# EAGLE design CommandeMoteurs (EAGLE 6.6.0)
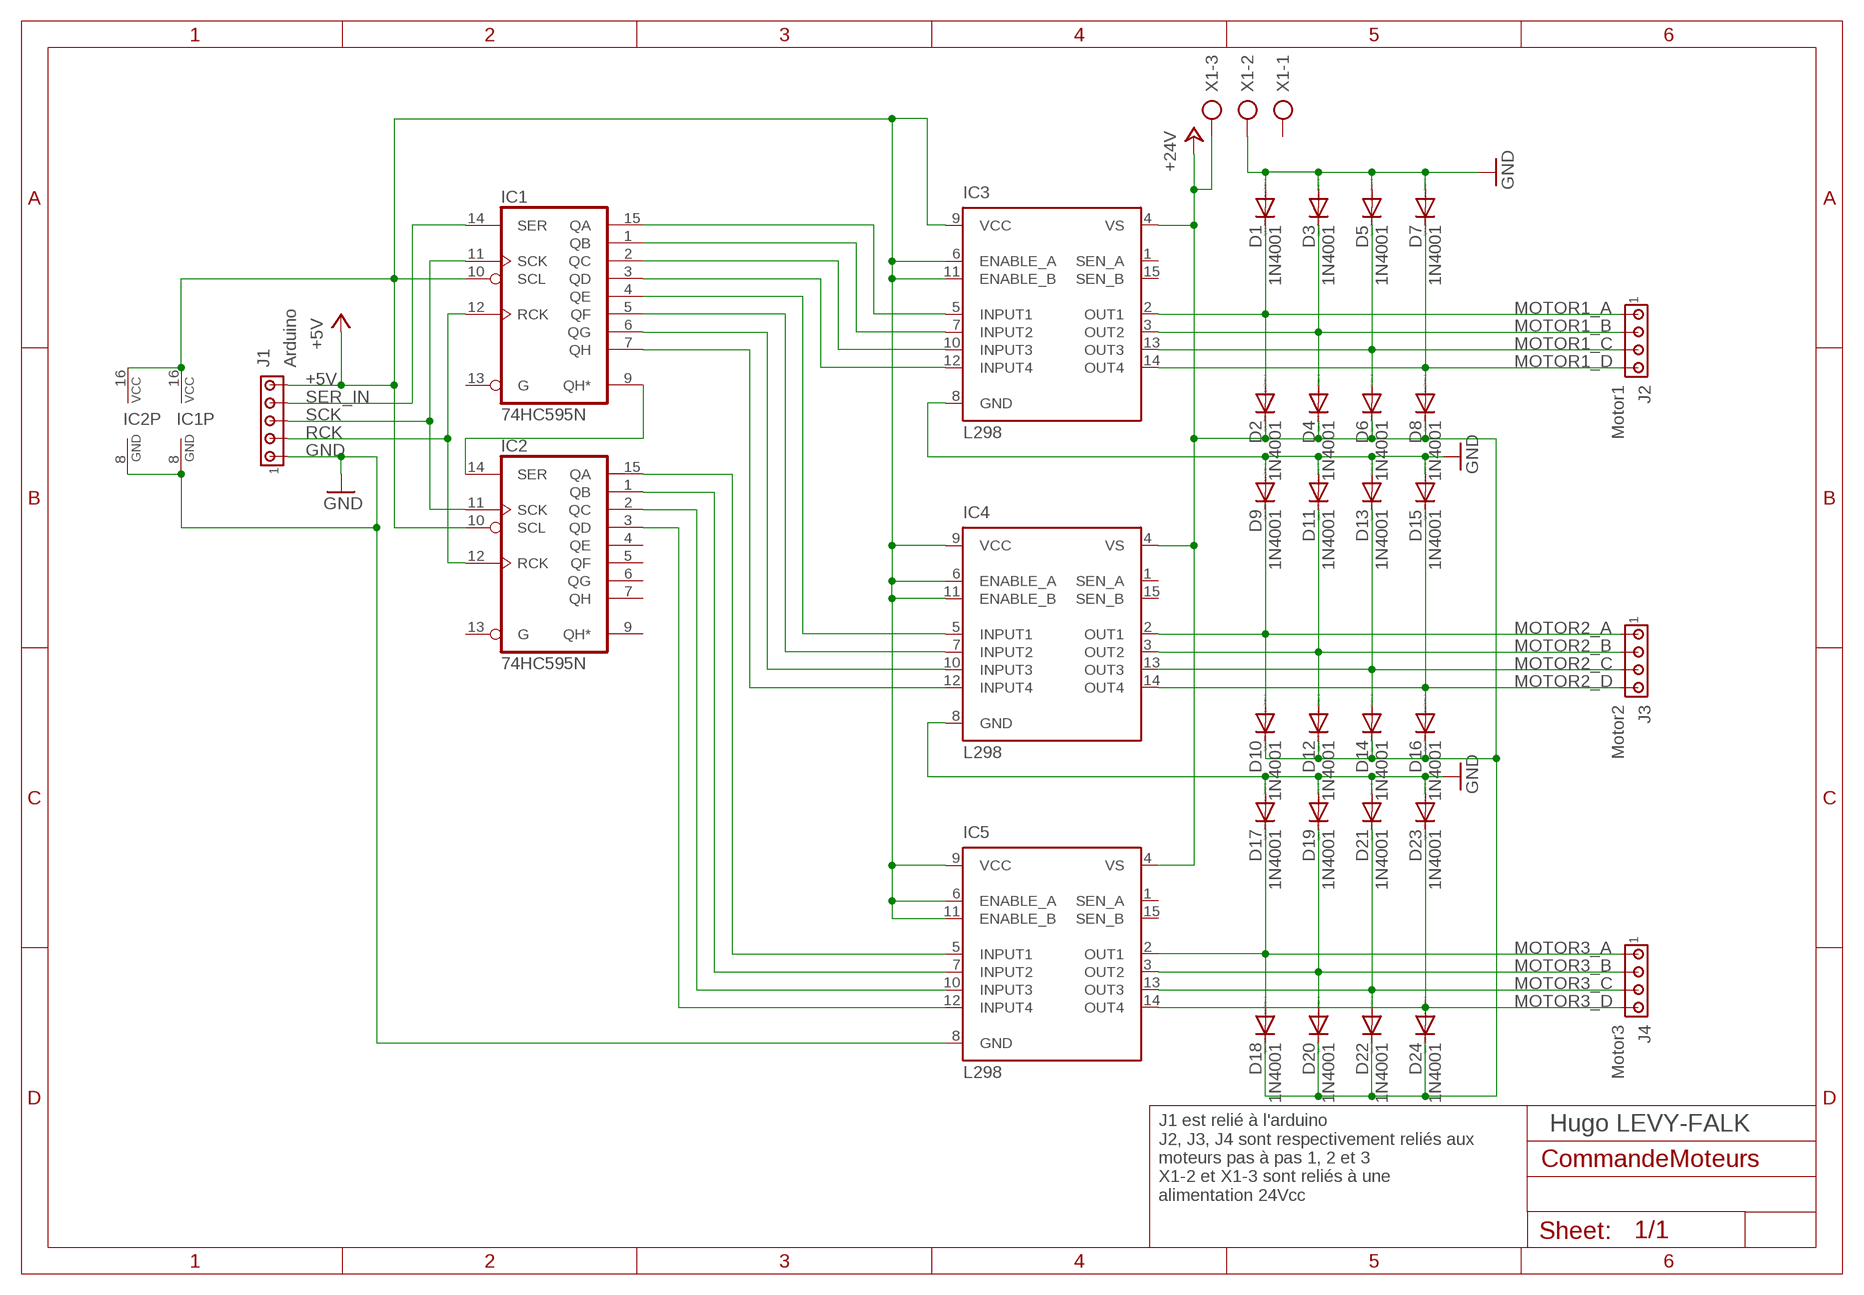
[diagram p0: schematic, sheet 1]

## Parts
D1  1N4001  DIODE-DO35-10  [DO35-10]
D2  1N4001  DIODE-DO35-10  [DO35-10]
D3  1N4001  DIODE-DO35-10  [DO35-10]
D4  1N4001  DIODE-DO35-10  [DO35-10]
D5  1N4001  DIODE-DO35-10  [DO35-10]
D6  1N4001  DIODE-DO35-10  [DO35-10]
D7  1N4001  DIODE-DO35-10  [DO35-10]
D8  1N4001  DIODE-DO35-10  [DO35-10]
D9  1N4001  DIODE-DO35-10  [DO35-10]
D10  1N4001  DIODE-DO35-10  [DO35-10]
D11  1N4001  DIODE-DO35-10  [DO35-10]
D12  1N4001  DIODE-DO35-10  [DO35-10]
D13  1N4001  DIODE-DO35-10  [DO35-10]
D14  1N4001  DIODE-DO35-10  [DO35-10]
D15  1N4001  DIODE-DO35-10  [DO35-10]
D16  1N4001  DIODE-DO35-10  [DO35-10]
D17  1N4001  DIODE-DO35-10  [DO35-10]
D18  1N4001  DIODE-DO35-10  [DO35-10]
D19  1N4001  DIODE-DO35-10  [DO35-10]
D20  1N4001  DIODE-DO35-10  [DO35-10]
D21  1N4001  DIODE-DO35-10  [DO35-10]
D22  1N4001  DIODE-DO35-10  [DO35-10]
D23  1N4001  DIODE-DO35-10  [DO35-10]
D24  1N4001  DIODE-DO35-10  [DO35-10]
IC1  74HC595N  [DIL16]
IC2  74HC595N  [DIL16]
IC3  L298  [MULTIWATT-15]
IC4  L298  [MULTIWATT-15]
IC5  L298  [MULTIWATT-15]
J1  Arduino  MTA05-100  [10X05MTA]
J2  Motor1  MTA04-100  [10X04MTA]
J3  Motor2  MTA04-100  [10X04MTA]
J4  Motor3  MTA04-100  [10X04MTA]
X1  AK500/3  [AK500/3]

## Nets
+5V: IC1.10(SCL) IC1.16(VCC) IC2.10(SCL) IC2.16(VCC) IC3.6(ENABLE_A) IC3.9(VCC) IC3.11(ENABLE_B) IC4.6(ENABLE_A) IC4.9(VCC) IC4.11(ENABLE_B) IC5.6(ENABLE_A) IC5.9(VCC) IC5.11(ENABLE_B) J1.5
+24V: D2.C D4.C D6.C D8.C D10.C D12.C D14.C D16.C D18.C D20.C D22.C D24.C IC3.4(VS) IC4.4(VS) IC5.4(VS) X1.3
GND: D1.A D3.A D5.A D7.A D9.A D11.A D13.A D15.A D17.A D19.A D21.A D23.A IC1.8(GND) IC2.8(GND) IC3.8(GND) IC4.8(GND) IC5.8(GND) J1.1 X1.2
MOTOR1_A: D1.C D2.A IC3.2(OUT1) J2.1
MOTOR1_B: D3.C D4.A IC3.3(OUT2) J2.2
MOTOR1_C: D5.C D6.A IC3.13(OUT3) J2.3
MOTOR1_D: D7.C D8.A IC3.14(OUT4) J2.4
MOTOR2_A: D9.C D10.A IC4.2(OUT1) J3.1
MOTOR2_B: D11.C D12.A IC4.3(OUT2) J3.2
MOTOR2_C: D13.C D14.A IC4.13(OUT3) J3.3
MOTOR2_D: D15.C D16.A IC4.14(OUT4) J3.4
MOTOR3_A: D17.C D18.A IC5.2(OUT1) J4.1
MOTOR3_B: D19.C D20.A IC5.3(OUT2) J4.2
MOTOR3_C: D21.C D22.A IC5.13(OUT3) J4.3
MOTOR3_D: D23.C D24.A IC5.14(OUT4) J4.4
N$4: IC1.15(QA) IC3.5(INPUT1)
N$5: IC1.1(QB) IC3.7(INPUT2)
N$6: IC1.2(QC) IC3.10(INPUT3)
N$7: IC1.3(QD) IC3.12(INPUT4)
N$8: IC1.4(QE) IC4.5(INPUT1)
N$9: IC1.5(QF) IC4.7(INPUT2)
N$10: IC1.6(QG) IC4.10(INPUT3)
N$11: IC1.7(QH) IC4.12(INPUT4)
N$12: IC1.9(QH*) IC2.14(SER)
N$13: IC2.15(QA) IC5.5(INPUT1)
N$14: IC2.1(QB) IC5.7(INPUT2)
N$15: IC2.2(QC) IC5.10(INPUT3)
N$16: IC2.3(QD) IC5.12(INPUT4)
RCK: IC1.12(RCK) IC2.12(RCK) J1.2
SCK: IC1.11(SCK) IC2.11(SCK) J1.3
SER_IN: IC1.14(SER) J1.4
Unconnected: IC1.13(G) IC2.4(QE) IC2.5(QF) IC2.6(QG) IC2.7(QH) IC2.9(QH*) IC2.13(G) IC3.1(SEN_A) IC3.15(SEN_B) IC4.1(SEN_A) IC4.15(SEN_B) IC5.1(SEN_A) IC5.15(SEN_B) X1.1

## Notes on the sheet
- J1 est relié à l'arduino
  J2, J3, J4 sont respectivement reliés aux
  moteurs pas à pas 1, 2 et 3
  X1-2 et X1-3 sont reliés à une
  alimentation 24Vcc
- Hugo LEVY-FALK

## Library data of the parts
D1-D24 = diode:DIODE-: DIODE
IC1 IC2 = 74xx-eu:74*595: 8-bit SHIFT REGISTER, output latch
IC3-IC5 = st-microelectronics:L298: DUAL FULL-BRIDGE DRIVER; MPN: L298N; OC_FARNELL: 1589425; OC_NEWARK: 32M1527
J1 = con-amp:MTA05-100: AMP connector
J2-J4 = con-amp:MTA04-100: AMP connector
X1 = con-ptr500:AK500/3: CONNECTOR; OC_FARNELL: unknown; OC_NEWARK: unknown

## Board
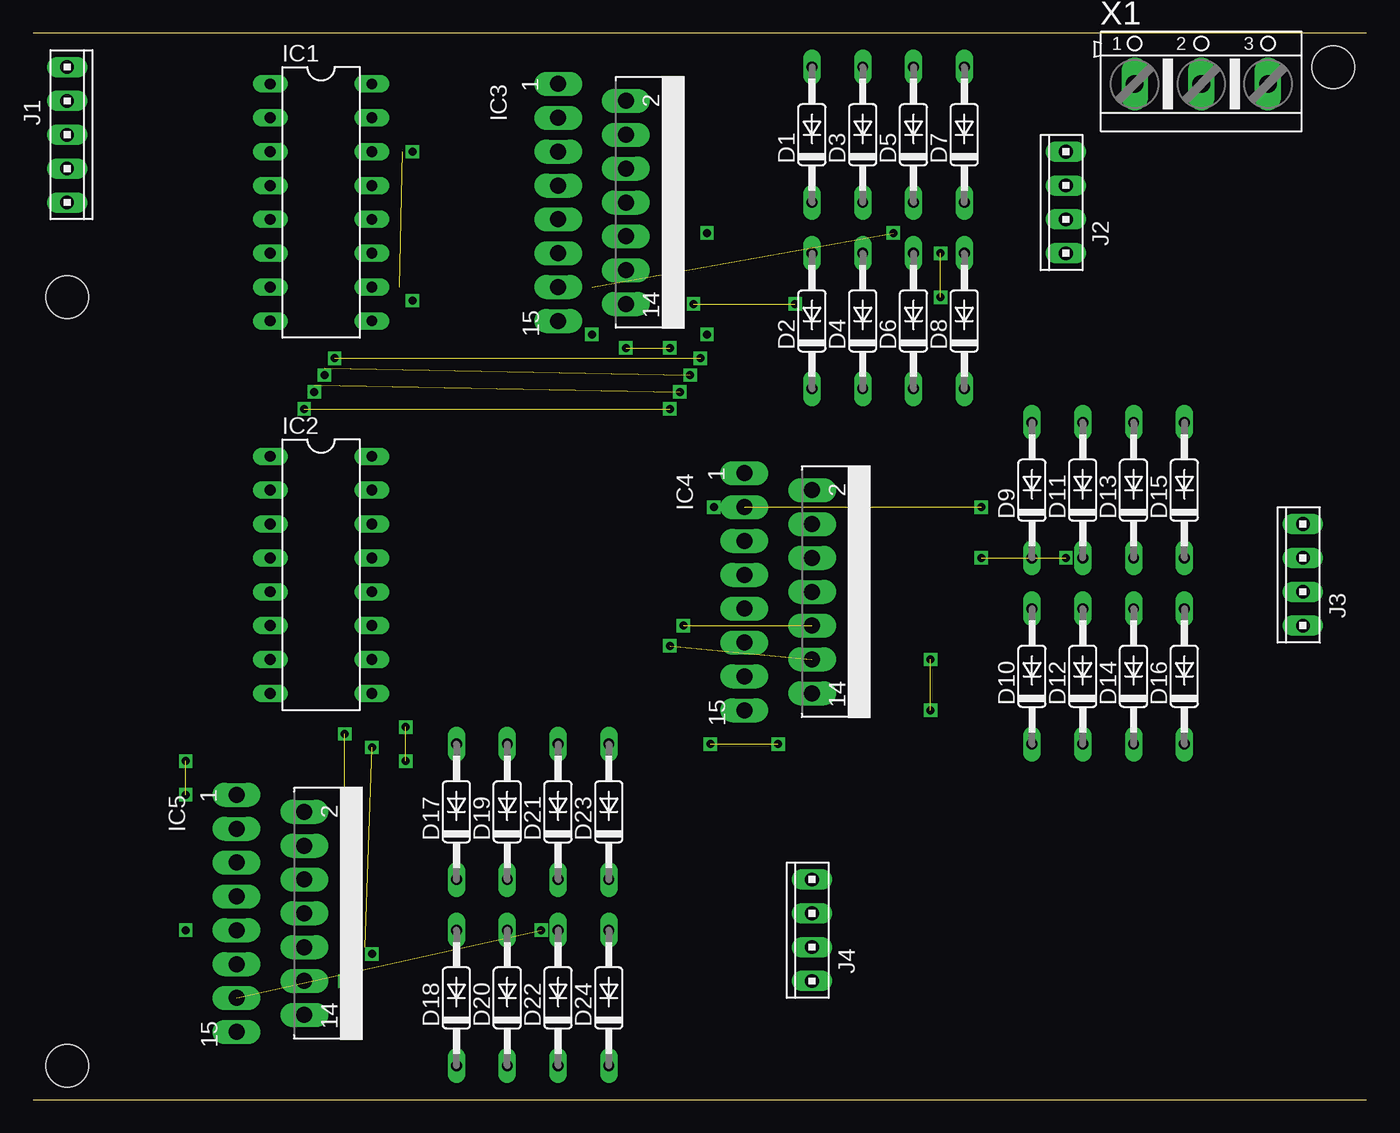
[diagram p1: board, top side]
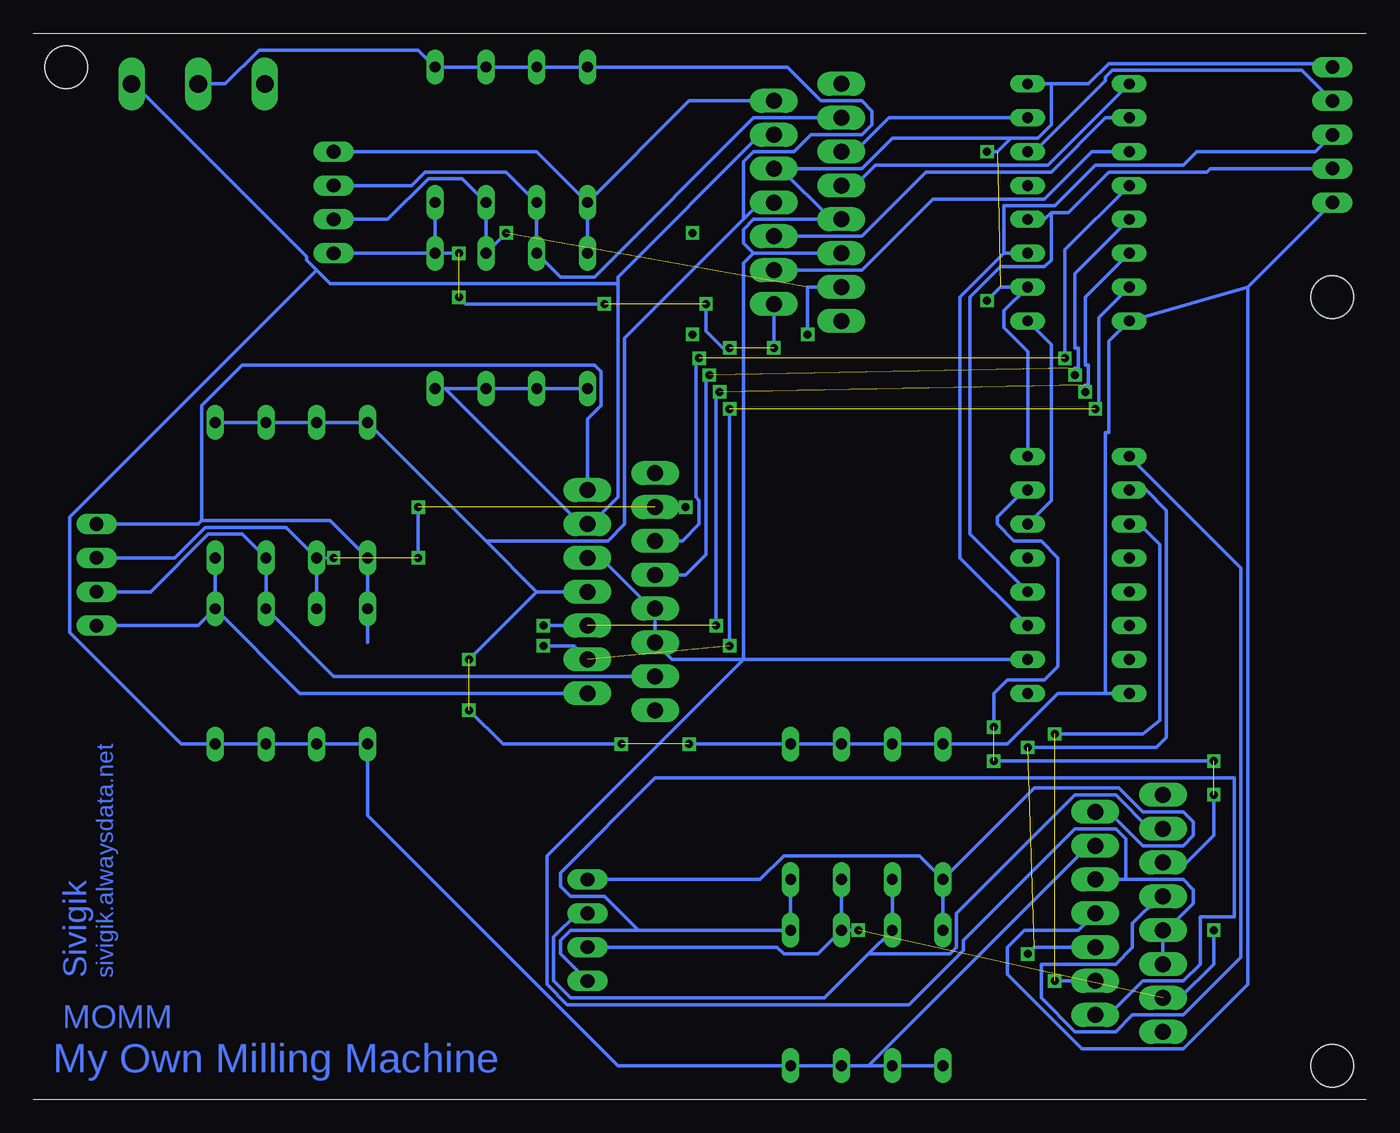
[diagram p2: board, bottom side, seen from below]

Size 100 x 80 mm. Coordinates in mm from the lower left corner, seen from the top.
Outline: 0,0 100,0
Outline: 100,80 0,80
Copper layers (1*16): Top 0.035mm / dielectric 1.5mm / Bottom 0.035mm
Design rules "default": minimum track width 10mil, minimum drill 24mil, track to track 8mil, track to pad 8mil, pad to pad 8mil, via to via 8mil, smd to smd 8mil, copper to edge 40mil, drill to drill 8mil, minimum pad ring 10mil, minimum via ring 8mil, stop-mask expansion 4mil, vias tented up to drill 0mil, thermal gap 10mil
Holes 3.2 mm at 2.54,2.54 97.54,77.47 2.54,60.2

### Footprints (pad centres in the part's own frame; a part is rotated, then mirrored left to right if it is on the bottom)
DO35-10 = drill 0.813 long: A 5.08,0; C -5.08,0
DIL16 = drill 0.813 long: 1 -8.89,-3.81; 2 -6.35,-3.81; 3 -3.81,-3.81; 4 -1.27,-3.81; 5 1.27,-3.81; 6 3.81,-3.81; 7 6.35,-3.81; 8 8.89,-3.81; 9 8.89,3.81; 10 6.35,3.81; 11 3.81,3.81; 12 1.27,3.81; 13 -1.27,3.81; 14 -3.81,3.81; 15 -6.35,3.81; 16 -8.89,3.81
MULTIWATT-15 = drill 1.2 long: 1 -8.89,-7.62; 2 -7.62,-2.54; 3 -6.35,-7.62; 4 -5.08,-2.54; 5 -3.81,-7.62; 6 -2.54,-2.54; 7 -1.27,-7.62; 8 0,-2.54; 9 1.27,-7.62; 10 2.54,-2.54; 11 3.81,-7.62; 12 5.08,-2.54; 13 6.35,-7.62; 14 7.62,-2.54; 15 8.89,-7.62
10X05MTA = drill 1.016 long: 1 5.08,0; 2 2.54,0; 3 0,0; 4 -2.54,0; 5 -5.08,0
10X04MTA = drill 1.016 long: 1 3.81,0; 2 1.27,0; 3 -1.27,0; 4 -3.81,0
AK500/3 = drill 1.321 long: 1 -5.004,0; 2 0,0; 3 5.004,0

### Placement (x,y rotation side)
D1  58.42,72.39 90 top
D2  58.42,58.42 90 top
D3  62.23,72.39 90 top
D4  62.23,58.42 90 top
D5  66.04,72.39 90 top
D6  66.04,58.42 90 top
D7  69.85,72.39 90 top
D8  69.85,58.42 90 top
D9  74.93,45.72 90 top
D10  74.93,31.75 90 top
D11  78.74,45.72 90 top
D12  78.74,31.75 90 top
D13  82.55,45.72 90 top
D14  82.55,31.75 90 top
D15  86.36,45.72 90 top
D16  86.36,31.75 90 top
D17  31.75,21.59 90 top
D18  31.75,7.62 90 top
D19  35.56,21.59 90 top
D20  35.56,7.62 90 top
D21  39.37,21.59 90 top
D22  39.37,7.62 90 top
D23  43.18,21.59 90 top
D24  43.18,7.62 90 top
IC1  21.59,67.31 270 top
IC2  21.59,39.37 270 top
IC3  46.99,67.31 270 top
IC4  60.96,38.1 270 top
IC5  22.86,13.97 270 top
J1  2.54,72.39 270 top
J2  77.47,67.31 90 top
J3  95.25,39.37 90 top
J4  58.42,12.7 90 top
X1  87.63,76.2 0 top

### Tracks (layer width: path | path; a pad name or v marks a point on that pad's centre or on a via)
+5V  (1 unrouted)
  Bottom 0.254: 23.62,76.2 20.83,76.2 19.3,77.72 2.79,77.72 J1.5 | 23.62,76.2 IC1.16 | 45.97,63.5 IC3.11 | 45.97,63.5 46.74,64.26 46.74,65.28 45.97,66.04 40.13,66.04 | 40.13,66.04 43.94,69.85 | 40.13,66.04 IC3.9 | 15.24,12.45 IC5.11 | 18.03,16.51 13.72,16.51 12.95,15.75 12.95,14.73 15.24,12.45 | 18.03,16.51 IC5.6 | 15.24,12.45 IC5.9 | IC2.16 25.4,56.13 27.18,57.91 27.18,59.18 IC1.10 27.43,60.96 28.45,59.94 | 46.74,33.02 52.07,33.02 IC4.11 53.34,36.58 | 46.74,33.02 IC2.10 | IC4.6 57.4,40.64 53.34,36.58 | 53.34,36.58 IC4.9 | 18.03,16.51 18.03,19.56 18.8,20.32 21.84,20.32 30.23,11.94 30.23,11.18 34.29,7.11 59.94,7.11 61.47,8.64 61.47,18.29 46.74,33.02 | 45.97,63.5 46.74,62.74 46.74,33.02 | 23.62,76.2 23.62,73.15 24.64,72.14 26.67,72.14 | 26.67,72.14 35.56,72.14 37.85,69.85 43.94,69.85 | 43.94,69.85 IC3.6 | 28.45,71.12 27.69,71.12 26.67,72.14
+24V
  Bottom 0.254: D2.C D4.C D6.C 69.09,53.34 | 69.09,53.34 D8.C | 69.09,53.34 58.93,43.18 IC4.4 58.17,43.18 56.13,45.21 56.13,61.21 | IC3.4 45.47,72.39 56.13,61.72 56.13,61.21 | 78.74,62.23 77.72,61.21 56.13,61.21 | 78.74,62.23 79.5,62.99 79.5,63.25 92.46,76.2 X1.3 | D18.C D20.C 37.34,2.54 | 37.34,2.54 D22.C D24.C 56.13,2.54 74.93,21.34 D10.C D12.C D14.C D16.C 88.9,26.67 97.28,35.05 97.28,43.69 78.74,62.23 | IC5.4 20.83,19.05 37.34,2.54
GND  (2 unrouted)
  Bottom 0.254: 19.56,30.48 23.11,30.48 26.92,26.67 D17.A D19.A D21.A D23.A 50.8,26.67 | 19.56,30.48 IC2.8 | 8.89,60.96 IC1.8 19.3,56.9 19.3,50.55 19.3,50.04 19.56,50.04 19.56,30.48 | J1.1 8.89,60.96 | IC5.8 21.59,12.7 25.65,12.7 26.92,11.43 26.92,9.4 21.34,3.81 13.72,3.81 8.89,8.64 8.89,60.96 | X1.2 85.6,76.2 83.06,78.74 71.12,78.74 D7.A D5.A D3.A D1.A 43.43,77.47 40.89,74.93 37.85,74.93 37.08,74.17 37.08,73.15 37.85,72.39 41.66,72.39 42.93,71.12 45.97,71.12 46.74,70.36 46.74,66.04 | D15.A D13.A D11.A D9.A 66.04,41.91 | 66.04,41.91 62.23,38.1 | IC3.8 45.47,67.31 46.74,66.04 | 46.74,66.04 55.63,57.15 55.63,43.18 56.9,41.91 66.04,41.91 | IC4.8 62.23,38.1 | 62.23,38.1 67.31,33.02 | 67.31,29.21 64.77,26.67 55.88,26.67
MOTOR1_A
  Bottom 0.254: D1.C D2.A | J2.1 62.23,71.12 D1.C | IC3.2 50.8,74.93 D1.C
MOTOR1_B
  Bottom 0.254: J2.2 71.63,68.58 70.61,69.6 64.52,69.6 D3.C D4.A 60.45,61.72 57.91,61.72 45.97,73.66 IC3.3
MOTOR1_C  (1 unrouted)
  Bottom 0.254: J2.3 73.41,66.04 70.36,69.09 67.82,69.09 D5.C D6.A 64.52,65.02 | IC3.13 41.91,60.96 41.91,57.4
MOTOR1_D  (3 unrouted)
  Bottom 0.254: D7.C D8.A | D8.A J2.4 | 68.07,60.2 67.56,59.69 57.15,59.69 | 68.07,63.5 D8.A | IC3.14 44.45,56.39 | 49.53,59.69 49.53,57.66 48.26,56.39 47.75,56.39
MOTOR2_A
  Bottom 0.254: 74.93,34.29 D10.A D9.C 77.72,43.43 87.38,43.43 | J3.1 87.63,43.18 87.38,43.43 | IC4.2 58.42,51.05 57.4,52.07 57.4,54.61 57.91,55.12 84.33,55.12 87.38,52.07 87.38,43.43
MOTOR2_B  (2 unrouted)
  Bottom 0.254: D11.C D12.A | J3.2 89.41,40.64 87.12,42.93 81.03,42.93 D11.C | 71.12,44.45 71.12,40.64 | D11.C 77.47,40.64 | IC4.3 51.05,44.45
MOTOR2_C
  Bottom 0.254: J3.3 91.19,38.1 86.87,42.42 84.33,42.42 D13.C D14.A 77.47,31.75 IC4.13
MOTOR2_D
  Bottom 0.254: D15.C D16.A | J3.4 87.63,35.56 D16.A | IC4.14 80.01,30.48 D16.A
MOTOR3_A
  Bottom 0.254: D17.C D18.A | J4.1 45.47,16.51 43.69,18.29 33.53,18.29 D17.C | IC5.2 19.3,21.59 16.76,19.05 13.72,19.05 12.95,19.81 12.95,20.83 13.72,21.59 16.76,21.59 18.54,23.37 24.89,23.37 D17.C
MOTOR3_B
  Bottom 0.254: D19.C D20.A 37.34,10.92 | J4.2 59.18,13.97 60.96,12.19 60.96,8.89 59.69,7.62 40.64,7.62 37.34,10.92 | IC5.3 16.26,20.32 18.8,22.86 21.84,22.86 30.73,13.97 30.73,11.43 31.24,10.92 37.34,10.92
MOTOR3_C  (1 unrouted)
  Bottom 0.254: D21.C D22.A | J4.3 44.2,11.43 43.69,10.92 41.15,10.92 D22.A | D22.A 38.1,12.7 | IC5.13 13.97,7.62 11.43,10.16 11.43,12.7
MOTOR3_D
  Bottom 0.254: D23.C D24.A 54.61,12.7 | J4.4 60.45,10.92 60.45,11.94 59.69,12.7 54.61,12.7 | IC5.14 19.3,6.35 16.76,8.89 13.72,8.89 12.45,10.16 12.45,13.72 9.91,13.72 9.91,24.13 53.34,24.13 60.45,17.02 60.45,16 59.69,15.24 57.15,15.24 54.61,12.7
N$1  (via drill 0.6)
  other vias: 11.43,12.7
N$2  (via drill 0.6)
  other vias: 38.1,12.7
N$3  (via drill 0.6)
  other vias: 50.8,26.67
N$4
  Bottom 0.254: IC1.15 35.81,73.66 38.35,71.12 IC3.5
N$5
  Bottom 0.254: IC1.1 23.88,70.1 36.83,70.1 38.35,68.58 IC3.7
N$6
  Bottom 0.254: IC1.2 19.56,73.66 23.62,69.6 33.02,69.6 37.85,64.77 IC3.10
N$7
  Bottom 0.254: IC1.3 20.57,71.12 24.13,67.56 32.51,67.56 37.85,62.23 IC3.12
N$8  (1 unrouted)
  Bottom 0.254: IC1.4 22.61,63.75 22.61,55.63 | 50.04,55.63 50.29,55.37 50.29,45.21 50.04,44.96 50.04,43.18 51.31,41.91 IC4.5
N$9  (1 unrouted)
  Bottom 0.254: IC1.5 21.84,61.98 21.84,56.39 21.59,56.39 21.59,54.86 21.84,54.86 21.84,54.36 | 49.28,54.36 49.53,54.1 49.53,40.89 51.05,39.37 IC4.7
N$10  (via drill 0.6)  (2 unrouted)
  Bottom 0.254: IC1.6 21.08,60.2 21.08,55.12 20.83,55.12 20.83,53.59 21.08,53.59 21.08,53.09 | 48.51,53.09 48.77,52.83 v48.77,35.56 | 61.72,35.56 IC4.10
N$11  (via drill 0.6)  (2 unrouted)
  Bottom 0.254: IC1.7 20.07,58.67 20.07,52.07 20.32,51.82 | 47.75,51.82 v47.75,34.04 | 61.72,34.04 59.44,34.04 IC4.12
N$12
  Bottom 0.254: IC2.14 23.62,44.96 23.62,56.64 IC1.9
N$13  (2 unrouted)
  Bottom 0.254: IC2.15 25.65,45.72 27.69,43.69 27.69,43.18 26.42,41.91 24.38,41.91 23.11,40.64 23.11,32.51 24.13,31.5 26.92,31.5 27.94,30.48 27.94,27.94 | IC5.5 13.46,17.78 11.43,19.81 11.43,22.86 | 27.94,25.4 11.43,25.4
N$14
  Bottom 0.254: IC2.1 9.4,39.88 9.4,10.67 13.72,6.35 17.53,6.35 18.8,5.08 21.84,5.08 24.38,7.62 24.38,10.16 18.8,10.16 17.53,11.43 17.53,13.21 15.49,15.24 IC5.7
N$15  (1 unrouted)
  Bottom 0.254: IC2.2 16.51,45.72 14.99,44.2 14.99,27.18 15.75,26.42 25.4,26.42 | IC5.10 24.89,11.43 25.27,11.05 | 25.27,11.05 25.4,10.92 | 25.4,11.18 25.27,11.05
N$16  (1 unrouted)
  Bottom 0.254: IC2.3 17.02,43.18 15.49,41.66 15.49,28.45 16.76,27.43 23.37,27.43 | 23.37,8.89 IC5.12
N$17  (via drill 0.6)
  other vias: 55.88,26.67
N$18  (via drill 0.6)
  other vias: 67.31,29.21
N$19  (via drill 0.6)
  other vias: 67.31,33.02
N$20  (via drill 0.6)
  other vias: 51.05,44.45
N$21  (via drill 0.6)
  other vias: 71.12,44.45
N$22  (via drill 0.6)
  other vias: 77.47,40.64
N$23  (via drill 0.6)
  other vias: 71.12,40.64
N$24  (via drill 0.6)
  other vias: 11.43,22.86
N$25  (via drill 0.6)
  other vias: 11.43,25.4
N$26  (via drill 0.6)
  other vias: 27.94,27.94
N$27  (via drill 0.6)
  other vias: 27.94,25.4
N$28  (via drill 0.6)
  other vias: 25.4,10.92
N$29  (via drill 0.6)
  other vias: 25.4,26.42
N$30  (via drill 0.6)
  other vias: 23.37,8.89
N$31  (via drill 0.6)
  other vias: 23.37,27.43
N$32  (via drill 0.6)
  other vias: 20.32,51.82
N$33  (via drill 0.6)
  other vias: 21.08,53.09
N$34  (via drill 0.6)
  other vias: 21.84,54.36
N$35  (via drill 0.6)
  other vias: 22.61,55.63
N$36  (via drill 0.6)
  other vias: 50.04,55.63
N$37  (via drill 0.6)
  other vias: 49.28,54.36
N$38  (via drill 0.6)
  other vias: 48.51,53.09
N$39  (via drill 0.6)
  other vias: 47.75,51.82
N$40  (via drill 0.6)
  other vias: 61.72,35.56
N$41  (via drill 0.6)
  other vias: 61.72,34.04
N$42  (via drill 0.6)
  other vias: 64.52,65.02
N$43  (via drill 0.6)
  other vias: 68.07,63.5
N$44  (via drill 0.6)
  other vias: 50.55,65.02
N$45  (via drill 0.6)
  other vias: 50.55,57.4
N$46  (via drill 0.6)
  other vias: 49.53,59.69
N$47  (via drill 0.6)
  other vias: 57.15,59.69
N$48  (via drill 0.6)
  other vias: 68.07,60.2
N$49  (via drill 0.6)
  other vias: 44.45,56.39
N$50  (via drill 0.6)
  other vias: 47.75,56.39
N$51  (via drill 0.6)
  other vias: 28.45,59.94
N$52  (via drill 0.6)
  other vias: 28.45,71.12
N$53  (via drill 0.6)
  other vias: 41.91,57.4
RCK
  Bottom 0.254: IC2.12 29.72,42.42 29.72,60.2 27.43,62.48 24.13,62.48 23.62,62.99 23.62,66.55 | J1.2 11.68,69.85 11.94,69.6 19.3,69.6 22.35,66.55 23.62,66.55 | 23.62,66.55 24.13,66.04 IC1.12
SCK
  Bottom 0.254: IC1.11 27.18,63.5 | 27.18,63.5 30.48,60.2 30.48,40.64 IC2.11 | J1.3 3.81,71.12 12.7,71.12 13.72,70.1 20.32,70.1 23.37,67.06 27.18,67.06 27.18,63.5
SER_IN
  Bottom 0.254: IC1.14 24.89,71.12 19.56,76.45 19.56,76.71 19.05,77.22 4.83,77.22 J1.4

### Text on the board
Bottom: sivigik.alwaysdata.net | Sivigik | MOMM | My Own Milling Machine